# EasyEDA Pro project 电池内阻仪.eprj, schematic 电池内阻仪
Create Date: 2022-08-27; Page Name: 电池内阻仪; Project Name: 电池内阻仪; Schematic Name: 电池内阻仪; Update Date: 2023-02-27; Company: 嘉立创EDA
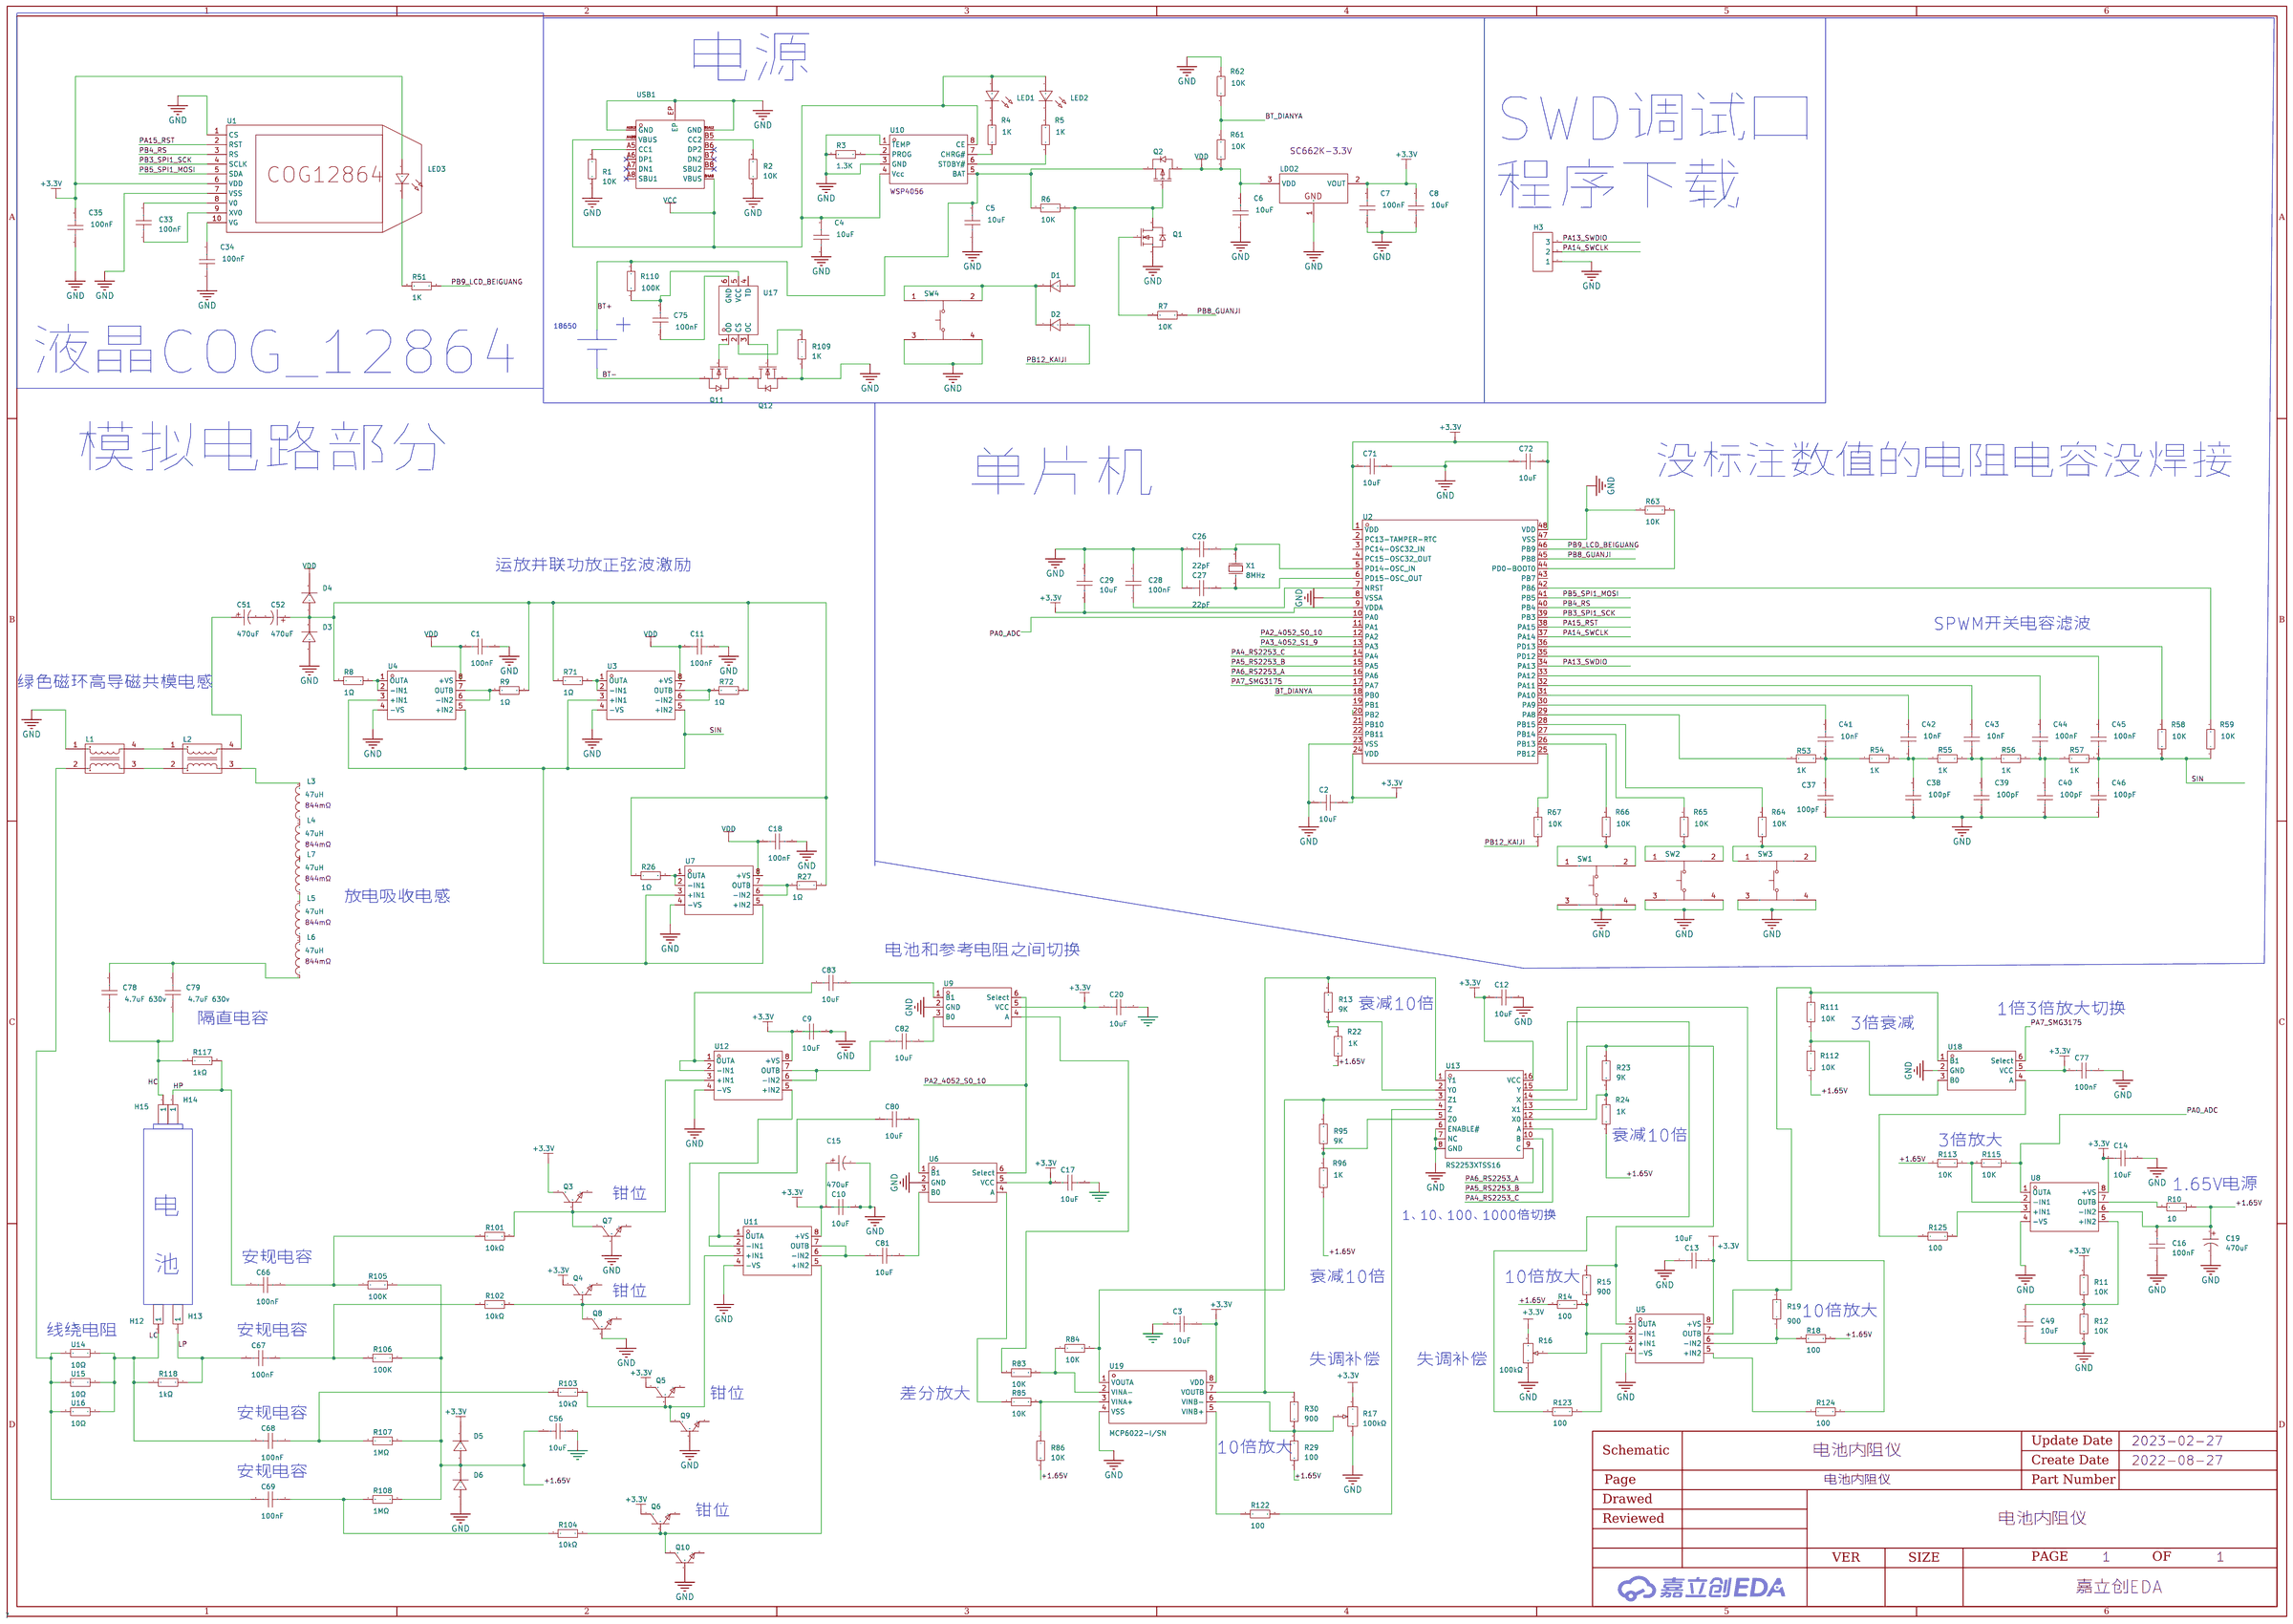
[diagram p0: schematic sheet]

## Parts
C1  100nF  [C0603]
C2  10uF  [C0603]
C3  10uF  [C0603]
C4  10uF  [C0603]
C5  10uF  [C0603]
C6  10uF  [C0603]
C7  100nF  [C0603]
C8  10uF  [C0603]
C9  10uF  [C0603]
C10  10uF  [C0603]
C11  100nF  [C0603]
C12  10uF  [C0603]
C13  10uF  [C0603]
C14  10uF  [C0603]
C15  470uF  [CAP-TH_BD8.0-P3.50-D0.6-FD]
C16  100nF  [C0603]
C17  10uF  [C0603]
C18  100nF  [C0603]
C19  470uF  [CAP-TH_BD8.0-P3.50-D0.6-FD]
C20  10uF  [C0603]
C26  22pF  [C0603]
C27  22pF  [C0603]
C28  100nF  [C0603]
C29  10uF  [C0603]
C33  100nF  [C0603]
C34  100nF  [C0603]
C35  100nF  [C0603]
C37  100pF  [C0603]
C38  100pF  [C0603]
C39  100pF  [C0603]
C40  100pF  [C0603]
C41  10nF  [C0603]
C42  10nF  [C0603]
C43  10nF  [C0603]
C44  100nF  [C0603]
C45  100nF  [C0603]
C46  100pF  [C0603]
C49  10uF  [C0603]
C51  470uF  [CAP-TH_BD8.0-P3.50-D0.6-FD]
C52  470uF  [CAP-TH_BD8.0-P3.50-D0.6-FD]
C56  10uF  [C0603]
C66  100nF  [CAP-TH_L13.0-W6.0-P10.00-D1.0]
C67  100nF  [CAP-TH_L13.0-W6.0-P10.00-D1.0]
C68  100nF  [CAP-TH_L13.0-W6.0-P10.00-D1.0]
C69  100nF  [CAP-TH_L13.0-W6.0-P10.00-D1.0]
C71  10uF  [C0603]
C72  10uF  [C0603]
C75  100nF  [C0603]
C77  100nF  [C0603]
C78  4.7uF 630v  [CAP-TH_L28.5-W15.5-P26.0-D0.8]
C79  4.7uF 630v  [CAP-TH_L28.5-W15.5-P26.0-D0.8]
C80  10uF  [C0603]
C81  10uF  [C0603]
C82  10uF  [C0603]
C83  10uF  [C0603]
D1  1N4148  [DO-35_BD2.0-L4.2-P8.20-D0.5-RD]
D2  1N4148  [DO-35_BD2.0-L4.2-P8.20-D0.5-RD]
D3  1N4148  [DO-35_BD2.0-L4.0-P8.00-D0.5-FD]
D4  1N4148  [DO-35_BD2.0-L4.0-P8.00-D0.5-FD]
D5  1N4148  [DO-35_BD2.0-L4.0-P8.00-D0.5-FD]
D6  1N4148  [DO-35_BD2.0-L4.0-P8.00-D0.5-FD]
H3  2.54-1*3P针  [HDR-TH_3P-P2.54-V-M-1]
H12  -  [HDR-TH_1P-V-M_XKB_X4611WV-01I-C28D40]
H13  -  [HDR-TH_1P-V-M_XKB_X4611WV-01I-C28D40]
H14  -  [HDR-TH_1P-V-M_XKB_X4611WV-01I-C28D40]
H15  -  [HDR-TH_1P-V-M_XKB_X4611WV-01I-C28D40]
L1  SLT1212V103MNP  [FILTER-TH_L18.0-W12.5-TL]
L2  SLT1212V103MNP  [FILTER-TH_L18.0-W12.5-TL]
L3  47uH  [IND-SMD_L4.5-W4.0_SLF0403]
L4  47uH  [IND-SMD_L4.5-W4.0_SLF0403]
L5  47uH  [IND-SMD_L4.5-W4.0_SLF0403]
L6  47uH  [IND-SMD_L4.5-W4.0_SLF0403]
L7  47uH  [IND-SMD_L4.5-W4.0_SLF0403]
LDO2  SC662K-3.3V  [SOT-23-3_L2.9-W1.3-P1.90-LS2.4-BR]
LED1  -  [LED-TH_BD3.0-P2.54-FD]
LED2  -  [LED-TH_BD3.0-P2.54-FD]
LED3  -  [LED-TH_BD3.0-P2.54-FD]
Q1  AO3400A  [SOT-23-3_L2.9-W1.3-P1.90-LS2.4-BR]
Q2  AO3401A  [SOT-23_L2.9-W1.3-P1.90-LS2.4-BR]
Q3  BC547  [TO-92-3_L4.5-W3.5-P1.27-L]
Q4  BC547  [TO-92-3_L4.5-W3.5-P1.27-L]
Q5  BC547  [TO-92-3_L4.5-W3.5-P1.27-L]
Q6  BC547  [TO-92-3_L4.5-W3.5-P1.27-L]
Q7  BC547  [TO-92-3_L4.5-W3.5-P1.27-L]
Q8  BC547  [TO-92-3_L4.5-W3.5-P1.27-L]
Q9  BC547  [TO-92-3_L4.5-W3.5-P1.27-L]
Q10  BC547  [TO-92-3_L4.5-W3.5-P1.27-L]
Q11  AO3400A  [SOT-23-3_L2.9-W1.3-P1.90-LS2.4-BR]
Q12  AO3400A  [SOT-23-3_L2.9-W1.3-P1.90-LS2.4-BR]
R1  10K  [R0603]
R2  10K  [R0603]
R3  1.3K  [R0603]
R4  1K  [R0603]
R5  1K  [R0603]
R6  10K  [R0603]
R7  10K  [R0603]
R8  1Ω  [R0603]
R9  1Ω  [R0603]
R10  10  [R0603]
R11  10K  [R0603]
R12  10K  [R0603]
R13  9K  [R0603]
R14  100  [R0603]
R15  900  [R0603]
R16  100kΩ  [RES-ADJ-TH_3P-L9.5-W4.9-P2.50-L_3296W]
R17  100kΩ  [RES-ADJ-TH_3P-L9.5-W4.9-P2.50-L_3296W]
R18  100  [R0603]
R19  900  [R0603]
R22  1K  [R0603]
R23  9K  [R0603]
R24  1K  [R0603]
R26  1Ω  [R0603]
R27  1Ω  [R0603]
R29  100  [R0603]
R30  900  [R0603]
R51  1K  [R0603]
R53  1K  [R0603]
R54  1K  [R0603]
R55  1K  [R0603]
R56  1K  [R0603]
R57  1K  [R0603]
R58  10K  [R0603]
R59  10K  [R0603]
R61  10K  [R0603]
R62  10K  [R0603]
R63  10K  [R0603]
R64  10K  [R0603]
R65  10K  [R0603]
R66  10K  [R0603]
R67  10K  [R0603]
R71  1Ω  [R0603]
R72  1Ω  [R0603]
R83  10K  [R0603]
R84  10K  [R0603]
R85  10K  [R0603]
R86  10K  [R0603]
R95  9K  [R0603]
R96  1K  [R0603]
R101  10kΩ  [RES-TH_BD2.3-L6.5-P10.50-D0.5]
R102  10kΩ  [RES-TH_BD2.3-L6.5-P10.50-D0.5]
R103  10kΩ  [RES-TH_BD2.3-L6.5-P10.50-D0.5]
R104  10kΩ  [RES-TH_BD2.3-L6.5-P10.50-D0.5]
R105  100K  [RES-TH_BD1.8-L3.2-P7.20-D0.4]
R106  100K  [RES-TH_BD1.8-L3.2-P7.20-D0.4]
R107  1MΩ  [RES-TH_BD1.8-L3.2-P7.20-D0.4]
R108  1MΩ  [RES-TH_BD1.8-L3.2-P7.20-D0.4]
R109  1K  [R0603]
R110  100K  [R0603]
R111  10K  [R0603]
R112  10K  [R0603]
R113  10K  [R0603]
R115  10K  [R0603]
R117  1kΩ  [Res_1/4W]
R118  1kΩ  [Res_1/4W]
R122  100  [R0603]
R123  100  [R0603]
R124  100  [R0603]
R125  100  [R0603]
SW1  TC-1109-C-B  [KEY-TH_4P-L4.5-W4.5-P3.00-LS5.8]
SW2  TC-1109-C-B  [KEY-TH_4P-L4.5-W4.5-P3.00-LS5.8]
SW3  TC-1109-C-B  [KEY-TH_4P-L4.5-W4.5-P3.00-LS5.8]
SW4  TC-1109-C-B  [KEY-TH_4P-L4.5-W4.5-P3.00-LS5.8]
U1  -  [FPC10]
U2  N32G430C8L7  [LQFP-48_L7.0-W7.0-P0.50-LS9.0-BL]
U3  COS722MR  [MSOP-8_L3.0-W3.0-P0.65-LS4.9-BL-1]
U4  COS722MR  [MSOP-8_L3.0-W3.0-P0.65-LS4.9-BL-1]
U5  COS722MR  [MSOP-8_L3.0-W3.0-P0.65-LS4.9-BL-1]
U6  SGM3157  [SC-70-6_L2.2-W1.3-P0.65-LS2.2-BR]
U7  COS722MR  [MSOP-8_L3.0-W3.0-P0.65-LS4.9-BL-1]
U8  COS722MR  [MSOP-8_L3.0-W3.0-P0.65-LS4.9-BL-1]
U9  SGM3157  [SC-70-6_L2.2-W1.3-P0.65-LS2.2-BR]
U10  WSP4056  [SOP-8_L5.1-W3.9-P1.27-LS6.0-BL]
U11  COS722MR  [MSOP-8_L3.0-W3.0-P0.65-LS4.9-BL-1]
U12  COS722MR  [MSOP-8_L3.0-W3.0-P0.65-LS4.9-BL-1]
U13  RS2253XTSS16  [TSSOP-16_L5.0-W4.4-P0.65-LS6.4-BL]
U14  10Ω  [RES-TH_BD6.0-L17.5-P21.50-D0.8]
U15  10Ω  [RES-TH_BD6.0-L17.5-P21.50-D0.8]
U16  10Ω  [RES-TH_BD6.0-L17.5-P21.50-D0.8]
U17  WSTDW01  [SOT-23-6_L2.9-W1.6-P0.95-LS2.8-BR]
U18  SGM3157  [SC-70-6_L2.2-W1.3-P0.65-LS2.2-BR]
U19  MCP6022-I/SN  [SOIC-8_L4.9-W3.9-P1.27-LS6.0-BL]
USB1  TYPEC-304-ACP16  [USB-C-SMD_TYPE-C-16P-1]
X1  8MHz  [OSC-TH_L10.0-W4.5-P5.00]

## Library data of the parts
C1 C4-C8 C11 C18 C26-C29 C33-C35 C37-C46 C49 = CAP_0603: 容值:100nF;精度:±10%;额定电压:50V;温度系数:X7R;; Supplier Footprint: 0603
C2 C3 C9 C10 C12-C14 C17 C20 C71 C72 = CL10A106KP8NNNC: 容值:10uF;精度:±10%;额定电压:10V;材质(温度系数):X5R;; LCSC Part Name: 10uF ±10% 10V; Supplier Part: C19702; Manufacturer: SAMSUNG(三星); Supplier Footprint: 0603; JLCPCB Part Class: Basic Part; Datasheet: https://atta.szlcsc.com/upload/public/pdf/source/20160103/1457707703378.pdf; Supplier: LCSC; Tolerance: ±10%; Voltage Rated: 10V; Temperature Coefficient: X5R
C15 C19 C51 C52 = KM477M016F12RR0VH2FP0: 容值:470uF;精度:±20%;额定电压:16V;电容体直径:8mm;电容体长度:12mm;脚间距:3.5mm;工作寿命:2000hrs@105;; LCSC Part Name: 470uF ±20% 16V; Supplier Part: C28067; Manufacturer: CX(承兴); Supplier Footprint: 直插,D8xL12mm; JLCPCB Part Class: Extended Part; Datasheet: https://atta.szlcsc.com/upload/public/pdf/source/20211027/06D6BA3719C264B639DC286D935D03EA.pdf; Supplier: LCSC; Tolerance: ±20%; Rated Voltage: 16V; φD: 8mm; L: 12mm; Lead Spacing: 3.5mm; Lifetime @ Temp: 2000hrs@105
C16 C56 C75 C77 C80-C83 = CAP_0603: Supplier Footprint: 0603
C66-C69 = MP2104K27C3X6LC: 等级:X2;容值:100nF;精度:±10%;; LCSC Part Name: 等级:X2 100nF ±10%; Supplier Part: C105759; Manufacturer: SRD(圣融达); Supplier Footprint: 插件,P=10mm; JLCPCB Part Class: Extended Part; Datasheet: https://atta.szlcsc.com/upload/public/pdf/source/20211112/28AD7BCA5F9A6D19E46F5213448E69C0.pdf; Supplier: LCSC; Subclass: X2; Tolerance: ±10%
C78 C79 = KP475J2J2603: 容值:4.7uF;精度:±5%;额定电压:630V;工作温度:-40℃~+100℃;额定电压(VAC):-;; LCSC Part Name: 4.7uF ±5% 630V; Supplier Part: C3019080; Manufacturer: KYET(科雅); Supplier Footprint: 径向引线,P=26mm; JLCPCB Part Class: Extended Part; Datasheet: https://atta.szlcsc.com/upload/public/pdf/source/20220523/12B2B36D66F3FE6DA8C3B05150F96247.pdf; Supplier: LCSC; Tolerance: ±5%; Voltage Rated: 630V; Operating Temperature: -40℃~+100℃
D1 D2 = 1N4148: 二极管配置:独立式;功率:500mW;直流反向耐压(Vr):75V;平均整流电流(Io):150mA;正向压降(Vf):1V@10mA;反向电流(Ir):5A@75V;反向恢复时间(trr):4ns;工作温度:+175@(Tj);; LCSC Part Name: 75V 150mA 4ns; Supplier Part: C406389; Manufacturer: GOOD-ARK(固锝); Supplier Footprint: DO-35; JLCPCB Part Class: Extended Part; Datasheet: https://atta.szlcsc.com/upload/public/pdf/source/20190724/C406389_39EB15FF1EE68DC8E61740104CC090CC.pdf; Supplier: LCSC; Diode Configuration: 独立式; Power Dissipation: 500mW; Reverse Voltage (Vr): 75V; Average Rectified Current (Io): 150mA; Forward Voltage (Vf@If): 1V@10mA; Reverse Leakage Current: 5A@75V; Reverse Recovery Time (trr): 4ns; Operating Temperature: +175@(Tj)
D3-D6 = 1N4148: 二极管配置:-;功率:500mW;直流反向耐压(Vr):75V;平均整流电流(Io):200mA;正向压降(Vf):1V@10mA;反向电流(Ir):5A@75V;反向恢复时间(trr):4ns;工作温度:+200@(Tj);; LCSC Part Name: 75V 200mA 4ns; Supplier Part: C14516; Manufacturer: ST(先科); Supplier Footprint: DO-35; JLCPCB Part Class: Extended Part; Datasheet: https://atta.szlcsc.com/upload/public/pdf/source/20140303/1457707004955.pdf; Supplier: LCSC; Power Dissipation: 500mW; Reverse Voltage (Vr): 75V; Average Rectified Current (Io): 200mA; Forward Voltage (Vf@If): 1V@10mA; Reverse Leakage Current: 5A@75V; Reverse Recovery Time (trr): 4ns; Operating Temperature: +200@(Tj)
H3 = 2.54-1*3P针: 间距:2.54mm;总PIN位数:3;排数:1;插针结构:1x3P;行距:-;安装类型:直插;圆针/方针:方针;额定电流:3A;额定电压:-;配合针长度:-;塑高:-;端接针长度:-;触头材质:-;触头镀层:-;工作温度范围:-40~+105;颜色:黑色;; LCSC Part Name: 2.54mm 1x3P 直插 方针; Supplier Part: C49257; Manufacturer: BOOMELE(博穆精密); Supplier Footprint: 插件,P=2.54mm; JLCPCB Part Class: Extended Part; Datasheet: https://atta.szlcsc.com/upload/public/pdf/source/20151109/1457707570948.pdf; Supplier: LCSC; Pitch: 2.54mm; Number of Pins: 3; Number of Rows: 1; Pin Structure: 1x3P; Mounting Type: 直插; Circluar Pins/Square Pins: 方针; Current Rating (Max): 3A; Operating Temperature Range: -40~+105; Color: 黑色
H12-H15 = HDR-M_2.54_1x1P: Supplier Part: C81276; Supplier Footprint: 插件; JLCPCB Part Class: Extended Part
L1 L2 = SLT1212V103MNP: DIP 1212 10mh 1.5A(min) 立式; LCSC Part Name: 共模电感; Supplier Part: C5149047; Manufacturer: Sunltech(韩国顺磁); Supplier Footprint: 插件; JLCPCB Part Class: Extended Part; Datasheet: https://atta.szlcsc.com/upload/public/pdf/source/20220824/B3B2927620CFCBD1665B2E124C02E741.pdf; Supplier: LCSC
L3-L7 = SLF0403-470KTT: 电感值:47uH;精度:±10%;额定电流:540mA;直流电阻(DCR):844mΩ;; LCSC Part Name: 47uH ±10% 540mA 844mΩ; Supplier Part: C182152; Manufacturer: Sunltech(韩国顺磁); Supplier Footprint: SMD; JLCPCB Part Class: Extended Part; Datasheet: https://atta.szlcsc.com/upload/public/pdf/source/20180622/C182152_7E479EAE8C34B9E34441182146F93730.pdf; Supplier: LCSC; Tolerance: ±10%; Rated Current: 540mA; DC Resistance (DCR): 844mΩ
LDO2 = SC662K-3.3V: 输出类型:固定;输出极性:正;输出通道数:1;最大输入电压:6V;输出电压:3.3V;压差:38mV@(10mA);输出电流:250mA;电源纹波抑制比(PRSS):50dB@(1kHz);; LCSC Part Name: Vin=6V Vout=3.3V 250mA 50dB@(1kHz); Supplier Part: C83932; Manufacturer: FM富满; Supplier Footprint: SOT-23(SOT-23-3); JLCPCB Part Class: Extended Part; Datasheet: https://atta.szlcsc.com/upload/public/pdf/watermark/20190926/C83932_A1FEE0F88F35A7AF4930BCB1098113C1.pdf; Supplier: LCSC; Output Type: 固定; Output Polarity: 正; Number of Outputs: 1; Maximum Input Voltage: 6V; Output Voltage: 3.3V; Dropout Voltage: 38mV@(10mA); Output Current: 250mA; Power Supply Rejection Ratio (PRSS): 50dB@(1kHz)
LED1-LED3 = LED_TH-R_3mm: Supplier Footprint: 插件
Q1 Q11 Q12 = AO3400A: 类型:N沟道;漏源电压(Vdss):30V;连续漏极电流(Id):5.8A;功率(Pd):1.4W;导通电阻(RDS(on)@Vgs,Id):35mΩ@10V,5.8A;阈值电压(Vgs(th)@Id):1.4V@250A;栅极电荷(Qg@Vgs):-;输入电容(Ciss@Vds):-;反向传输电容(Crss@Vds):-;; LCSC Part Name: N沟道 30V 5.8A; Supplier Part: C347475; Manufacturer: UMW(友台半导体); Supplier Footprint: SOT-23; JLCPCB Part Class: Extended Part; Datasheet: https://atta.szlcsc.com/upload/public/pdf/source/20220429/98B7D6B2B83615ED4523A0C76368EB06.pdf; Supplier: LCSC; Type: N沟道; Drain Source Voltage (Vdss): 30V; Continuous Drain Current (Id): 5.8A; Power Dissipation (Pd): 1.4W; Drain Source On Resistance (RDS(on)@Vgs,Id): 35mΩ@10V,5.8A; Gate Threshold Voltage (Vgs(th)@Id): 1.4V@250A
Q2 = AO3401A_C347476: 类型:P沟道;漏源电压(Vdss):30V;连续漏极电流(Id):4.1A;功率(Pd):350mW;导通电阻(RDS(on)@Vgs,Id):65mΩ@10V,4.2A;阈值电压(Vgs(th)@Id):1.3V@250A;; LCSC Part Name: P沟道 30V 4.1A; Supplier Part: C347476; Manufacturer: UMW(友台半导体); Supplier Footprint: SOT-23; JLCPCB Part Class: Extended Part; Datasheet: https://atta.szlcsc.com/upload/public/pdf/source/20220429/6D4E5D1601502BF561E1E660606ADA95.pdf; Supplier: LCSC; Type: P沟道; Drain Source Voltage (Vdss): 30V; Continuous Drain Current (Id): 4.1A; Power Dissipation (Pd): 350mW; Drain Source On Resistance (RDS(on)@Vgs,Id): 65mΩ@10V,4.2A; Gate Threshold Voltage (Vgs(th)@Id): 1.3V@250A
Q3-Q10 = BC547: LCSC Part Name: BC547 420-800 420-800; Supplier Part: C2910381; Manufacturer: CJ(江苏长电/长晶); Supplier Footprint: TO-92; JLCPCB Part Class: Extended Part; Datasheet: https://atta.szlcsc.com/upload/public/pdf/source/20220322/35437BB3E522E0C3E451097265A180DC.pdf; Supplier: LCSC
R1-R15 R18 R19 R22-R24 R26 R27 R29 R30 R51 R53-R59 R61-R67 R71 R72 R83-R86 R95 R96 R109-R113 R115 R122-R125 = Res_0603: Supplier Footprint: 0603
R16 R17 = 3296W-1-104_C118963: 阻值:100kΩ;精度:±10%;; LCSC Part Name: 100kΩ ±10% 短柄; Supplier Part: C118963; Manufacturer: BOCHEN(博晨); Manufacturer Part: 3296W-1-104; Supplier Footprint: 插件; JLCPCB Part Class: Extended Part; Datasheet: https://atta.szlcsc.com/upload/public/pdf/source/20171114/C118963_15106326662041117450.pdf; Supplier: LCSC; Tolerance: ±10%
R101-R104 = MF1/4W-10KΩ±1% T: 电阻类型:金属膜电阻;阻值:10kΩ;精度:±1%;温度系数:±100ppm/℃;最大工作电压:250V;工作温度范围:-55℃~+155℃;; LCSC Part Name: 金属膜电阻 10kΩ ±1%; Supplier Part: C119347; Manufacturer: CCO(千志电子); Supplier Footprint: 轴向引线; JLCPCB Part Class: Extended Part; Datasheet: https://atta.szlcsc.com/upload/public/pdf/source/20170718/C119347_1500346113643823003.pdf; Supplier: LCSC; Type: 金属膜电阻; Tolerance: ±1%; Temperature Coefficient: ±100ppm/℃; Overload Voltage (Max): 250V; Operating Temperature Range: -55℃~+155℃
R105-R108 = MF1/8W-100KΩ±1% T: 电阻类型:金属膜电阻;阻值:100kΩ;精度:±1%;功率:125mW;温度系数:±100ppm/℃;最大工作电压:150V;工作温度范围:-55℃~+155℃;; LCSC Part Name: 金属膜电阻 100kΩ ±1% 125mW; Supplier Part: C119225; Manufacturer: CCO(千志电子); Supplier Footprint: 插件,1.8x3.2mm; JLCPCB Part Class: Extended Part; Datasheet: https://atta.szlcsc.com/upload/public/pdf/source/20170718/C119225_1500346032771822881.pdf; Supplier: LCSC; Type: 金属膜电阻; Tolerance: ±1%; Power(Watts): 125mW; Temperature Coefficient: ±100ppm/℃; Overload Voltage (Max): 150V; Operating Temperature Range: -55℃~+155℃
R117 R118 = Res_AXIAL-1/4W: Supplier Footprint: 轴向引线
SW1-SW4 = TC-1109-C-B: 触点电流:50mA;额定电压(DC):12V;绝缘电阻:100mΩ;电路结构:单刀单掷;安装方式:直插;按钮形状:圆形按钮;按钮/盖帽颜色:黑色;带灯:无;作用力:260gf;机械寿命:100000;工作温度:-30~+85;引脚样式:PC引脚;开关长度:4.5mm;开关宽度:4.5mm;开关高度:4.3mm;带支架:否;; LCSC Part Name: 4.5*4.5*4.3 260gf 铜盖; Supplier Part: C381028; Manufacturer: XKB Connectivity(中国星坤); Supplier Footprint: 插件; JLCPCB Part Class: Extended Part; Datasheet: https://atta.szlcsc.com/upload/public/pdf/source/20200227/C381028_73BC0AA899763C0E54C1A3BBF749C676.pdf; Supplier: LCSC; Contact Current: 50mA; Voltage Rating (DC): 12V; Insulation Resistance: 100mΩ; Circuit: 单刀单掷; Mounting Style: 直插; Actuator Style: 圆形按钮; Actuator/Cap Color: 黑色; With Lamp: 无; Operating Force: 260gf; Mechanical Life: 100000; Operating Temperature: -30~+85; Pin Style: PC引脚; Switch Length: 4.5mm; Switch Width: 4.5mm; Switch Height: 4.3mm; Strike Gundam: 否
U1 = COG12864
U2 = N32G430C8L7: Supplier Part: C3032170; Manufacturer: Nations(国民技术); Supplier Footprint: LQFP48; JLCPCB Part Class: Extended Part; Datasheet: https://atta.szlcsc.com/upload/public/pdf/source/20220608/411F2C1C49F3955F5F0689A973473AF7.pdf; Supplier: LCSC
U3-U5 U7 U8 U11 U12 = COS722MR: 运放类型:低噪声运放;放大器组数:2;增益带宽积（GBP）:10MHz;压摆率（SR）:7.5 V/us;电源电压:2.1V ~ 5.5V;各通道供电电流:650uA;; LCSC Part Name: COS722MR 3级(168小时); Supplier Part: C726653; Manufacturer: COSINE(科山芯创); Supplier Footprint: MSOP-8; JLCPCB Part Class: Extended Part; Datasheet: https://atta.szlcsc.com/upload/public/pdf/source/20200925/C726653_8C4DEEE918D81B4566489376FD74F88A.pdf; Supplier: LCSC; Amplifier Type: 低噪声运放; Number of Circuits: 2; Voltage - Input Offset（Vos）: 5mV; Gain Bandwidth Product（GBP）: 10MHz; Slew Rate（SR）: 7.5 V/us; Output Type: Rail-to-Rail; Supply Voltage（Single）: 2.1V ~ 5.5V; Iq per channel (Typ): 650uA; Operating Temperature: -40~125
U6 U9 U18 = SGM3157: Supplier Part: C394901; Manufacturer: UMW(广东友台半导体); Supplier Footprint: SC-70-6; JLCPCB Part Class: Extended Part; Datasheet: https://atta.szlcsc.com/upload/public/pdf/source/20190529/C394901_0B4C9AD2B2C4D7402A9B434ADF7451EE.pdf; Supplier: LCSC
U10 = WSP4056: Supplier Part: C2985892; Manufacturer: WINSOK(微硕); Supplier Footprint: SOP-8; JLCPCB Part Class: Extended Part; Datasheet: https://atta.szlcsc.comnull; Supplier: LCSC
U13 = RS2253XTSS16: 开关电路:-;多路复用器/解复用器电路:-;导通电阻（最大值）:-;开关电压（最大值）:-;; Supplier Part: C2762339; Manufacturer: RUNIC(润石); Supplier Footprint: TSSOP-16; JLCPCB Part Class: Extended Part; Datasheet: https://atta.szlcsc.com/upload/public/pdf/watermark/20210326/C2762339_0D7BE0EC467357171233AF24BCA0D313.pdf; Supplier: LCSC
U14-U16 = KNP3W-10Ω±1%-9T73: 电阻类型:绕线电阻;阻值:10Ω;精度:±1%;功率:3W;温度系数:±350ppm/℃;最大工作电压:500V;工作温度范围:-55℃~+155℃;; LCSC Part Name: 绕线电阻 10Ω ±1% 3W; Supplier Part: C2843016; Manufacturer: VO(翔胜); Supplier Footprint: 插件,6x17mm; JLCPCB Part Class: Extended Part; Datasheet: https://atta.szlcsc.com/upload/public/pdf/source/20200609/C601736_823D5FEC32C33ED68EDB1181C52D1F38.pdf; Supplier: LCSC; Type: 绕线电阻; Tolerance: ±1%; Power(Watts): 3W; Temperature Coefficient: ±350ppm/℃; Overload Voltage (Max): 500V; Operating Temperature Range: -55℃~+155℃
U17 = WSTDW01: 充电电池的类型:-;电池单元组数:-;最大充电电流:-;充满的电池组电压:-;最大供应电压:-;; Supplier Part: C86873; Manufacturer: WINSOK(微硕); Supplier Footprint: SOT-23-6; JLCPCB Part Class: Extended Part; Datasheet: https://atta.szlcsc.com/upload/public/pdf/source/20161110/1478743415995.pdf; Supplier: LCSC
U19 = MCP6022-I/SN: 运放类型:宽带运放;放大器组数:2;增益带宽积（GBP）:10MHz;压摆率（SR）:7 V/us;电源电压:2.5V ~ 5.5V;各通道供电电流:1mA;; Supplier Part: C34047; Manufacturer: MICROCHIP(美国微芯); Supplier Footprint: SOIC-8-150mil; JLCPCB Part Class: Extended Part; Datasheet: https://atta.szlcsc.com/upload/public/pdf/source/20140723/1457707156733.pdf; Supplier: LCSC; Amplifier Type: 宽带运放; Number of Circuits: 2; Current - Input Bias（Ib）: 1pA; Voltage - Input Offset（Vos）: 500uV; Gain Bandwidth Product（GBP）: 10MHz; Slew Rate（SR）: 7 V/us; Output Type: 满摆幅; Supply Voltage（Single）: 2.5V ~ 5.5V; Iq per channel (Typ): 1mA; Operating Temperature: -40℃~85℃
USB1 = TYPEC-304-ACP16: 连接器类型:Type-C;公母:母座;触点数量:16;端口数量:1;安装方式:卧贴;额定电流 - 电源:3A;工作温度范围:-40~+85;; LCSC Part Name: Type-C 母座 卧贴; Supplier Part: C2982555; Manufacturer: XUNPU(讯普); Supplier Footprint: SMD; JLCPCB Part Class: Extended Part; Datasheet: https://atta.szlcsc.com/upload/public/pdf/source/20220311/3C907F75E12F45E4EE7F73565AB9C294.pdf; Supplier: LCSC; Connector Type: Type-C; Gender: 母座; Number of Contacts: 16; Number of Ports: 1; Mounting Style: 卧贴; Current Rating - Power (Max): 3A; Operating Temperature Range: -40~+85
X1 = X49SD8MSD2SC: 晶振类型:49S晶振;频率:8MHz;频率公差:±20ppm;频率稳定度:±30ppm;负载电容:20pF;工作温度:-20~+70;; LCSC Part Name: 8MHz ±20ppm 20pF; Supplier Part: C21263; Manufacturer: YXC(扬兴科技); Supplier Footprint: HC-49S-2P; JLCPCB Part Class: Extended Part; Datasheet: https://atta.szlcsc.com/upload/public/pdf/source/20210903/A997D130AE99CBB55D9024F9BE6DA174.pdf; Supplier: LCSC; Crystal Type: 49S晶振; Frequency Tolerance: ±20ppm; Frequency Stability: ±30ppm; Load Capacitance: 20pF; Operating Temperature: -20~+70

## Nets
+1.65V: C16.2 C19.1 C56.2 D5.1(A) D6.2(C) R10.1 R14.1 R18.1 R22.1 R24.1 R29.1 R86.2 R96.1 R105.2 R106.2 R107.2 R108.2 R112.2 R113.1 U8.6(-IN2)
+3.3V: C2.2 C3.1 C7.2 C8.2 C9.1 C10.1 C12.1 C13.2 C14.1 C17.1 C20.1 C29.1 C35.2 C71.1 C72.2 C77.1 D5.2(C) LDO2.2(VOUT) LED3.1(C) Q3.1(C) Q4.1(C) Q5.1(C) Q6.1(C) R11.2 R16.1 R17.1 U1.6(VDD) U2.1(VDD) U2.9(VDDA) U2.24(VDD) U2.48(VDD) U5.8(+VS) U6.5(VCC) U8.8(+VS) U9.5(VCC) U11.8(+VS) U12.8(+VS) U13.16(VCC) U18.5(VCC) U19.8(VDD)
GND: C1.2 C2.1 C3.2 C4.1 C5.1 C6.1 C7.1 C8.1 C9.2 C10.2 C11.2 C12.2 C13.1 C14.2 C15.1 C15.2 C16.1 C17.2 C18.2 C19.2 C20.2 C26.1 C27.1 C28.2 C29.2 C34.1 C35.1 C37.1 C38.1 C39.1 C40.1 C46.1 C49.1 C56.1 C71.2 C72.1 C77.2 D3.1(A) D6.1(A) H3.1 L1.1 LDO2.1(GND) Q1.2(S) Q7.2(B) Q8.2(B) Q9.2(B) Q10.2(B) Q12.2(S) R1.2 R2.1 R3.1 R12.1 R16.3 R17.3 R62.2 R63.1 R109.1 SW1.3 SW1.4 SW2.3 SW2.4 SW3.3 SW3.4 SW4.3 SW4.4 U1.1(CS) U1.7(VSS) U2.8(VSSA) U2.23(VSS) U2.47(VSS) U3.4(-VS) U4.4(-VS) U5.4(-VS) U6.2(GND) U7.4(-VS) U8.4(-VS) U9.2(GND) U10.1(TEMP) U10.3(GND) U11.4(-VS) U12.4(-VS) U13.6(ENABLE#) U13.7(NC) U13.8(GND) U18.2(GND) U19.4(VSS) USB1.A1B12(GND) USB1.B1A12(GND) USB1.EP
VCC: C4.2 LED1.1(C) LED2.1(C) U10.4(Vcc) U10.8(CE) USB1.A4B9(VBUS) USB1.B4A9(VBUS)
VDD: C1.1 C6.2 C11.1 C18.1 D4.2(C) LDO2.3(VDD) Q2.3(D) R61.1 U3.8(+VS) U4.8(+VS) U7.8(+VS)
BT+: C5.2 Q2.2(S) R6.2 R110.1 U10.5(BAT)
BT-: Q11.2(S)
BT_DIANYA: R61.2 R62.1 U2.18(PB0)
HC: C78.1 C79.1 H15.1 R117.1
HP: C66.2 H14.1 R117.2
LC: C68.2 H12.1 R118.1 U14.2 U15.2 U16.2
LP: C67.2 H13.1 R118.2
PA0_ADC: R115.2 U2.10(PA0) U8.1(OUTA)
PA2_4052_S0_10: U2.12(PA2) U6.6(Select) U9.6(Select)
PA3_4052_S1_9: U2.13(PA3)
PA4_RS2253_C: U2.14(PA4) U13.11(A)
PA5_RS2253_B: U2.15(PA5) U13.10(B)
PA6_RS2253_A: U2.16(PA6) U13.9(C)
PA7_SMG3175: U2.17(PA7) U18.6(Select)
PA13_SWDIO: H3.3 U2.34(PA13)
PA14_SWCLK: H3.2 U2.37(PA14)
PA15_RST: U1.2(RST) U2.38(PA15)
PB3_SPI1_SCK: U1.4(SCLK) U2.39(PB3)
PB4_RS: U1.3(RS) U2.40(PB4)
PB5_SPI1_MOSI: U1.5(SDA) U2.41(PB5)
PB8_GUANJI: R7.1 U2.45(PB8)
PB9_LCD_BEIGUANG: R51.2 U2.46(PB9)
PB12_KAIJI: D2.2(A) R67.1
SIN: C45.1 C46.2 R57.2 R58.1 R59.1 U3.3(+IN1) U3.5(+IN2) U4.3(+IN1) U4.5(+IN2) U7.3(+IN1) U7.5(+IN2)
$1N5478: R1.1 USB1.A5(CC1)
$1N5501: R2.2 USB1.B5(CC2)
$1N5982: R3.2 U10.2(PROG)
$1N6392: LED1.2(A) R4.2
$1N6468: LED2.2(A) R5.2
$1N6485: R4.1 U10.7(CHRG#)
$1N7176: R5.1 U10.6(STDBY#)
$1N9972: D1.2(A) Q1.3(D) Q2.1(G) R6.1
$1N10161: Q1.1(G) R7.2
$1N55108: C26.2 U2.5(PD14-OSC_IN) X1.1(OSC1)
$1N55316: C27.2 U2.6(PD15-OSC_OUT) X1.2(OSC2)
$1N56684: C28.1 U2.7(NRST)
$1N65263: C33.2 U1.8(V0)
$1N65484: C33.1 U1.9(XV0)
$1N65778: C34.2 U1.10(VG)
$1N76678: LED3.2(A) R51.1
$1N79731: R53.1 U2.29(PA8)
$1N83028: C38.2 C42.1 R54.2 R55.1
$1N83269: C39.2 C43.1 R55.2 R56.1
$1N83512: C40.2 C44.1 R56.2 R57.1
$1N86336: C41.2 U2.30(PA9)
$1N86592: C42.2 U2.31(PA10)
$1N86848: C43.2 U2.32(PA11)
$1N87104: C44.2 U2.33(PA12)
$1N87360: C45.2 U2.35(PD12)
$1N88068: R58.2 U2.36(PD13)
$1N90333: R59.2 U2.42(PB6)
$1N104798: R63.2 U2.44(PD0-BOOT0)
$1N112001: R67.2 U2.25(PB12)
$1N112276: R66.2 U2.26(PB13)
$1N112550: R65.2 U2.27(PB14)
$1N112826: R64.2 U2.28(PB15)
$1N150454: D1.1(C) D2.1(C) SW4.1 SW4.2
$1N155250: R66.1 SW1.1 SW1.2
$1N156292: R65.1 SW2.1 SW2.2
$1N157433: R64.1 SW3.1 SW3.2
$1N176679: C37.2 C41.1 R53.2 R54.1
$1N236262: R71.2 U3.1(OUTA) U3.2(-IN1)
$1N418401: R72.1 U3.6(-IN2) U3.7(OUTB)
$1N487783: C52.1 D3.2(C) D4.1(A) R8.1 R9.2 R26.1 R27.2 R71.1 R72.2
$1N488293: R8.2 U4.1(OUTA) U4.2(-IN1)
$1N488294: R9.1 U4.6(-IN2) U4.7(OUTB)
$1N489967: C51.2 C52.2
$1N490575: L1.4 L2.1
$1N490975: C51.1 L2.4
$1N503194: C66.1 R101.1 R105.1
$1N503385: C67.1 R102.1 R106.1
$1N503576: C68.1 R103.1 R107.1
$1N503767: C69.1 R104.1 R108.1
$1N568131: R26.2 U7.1(OUTA) U7.2(-IN1)
$1N568132: R27.1 U7.6(-IN2) U7.7(OUTB)
$1N576878: L3.1 L4.2
$1N578962: L4.1 L7.2
$1N579100: L5.2 L7.1
$1N579238: L5.1 L6.2
$1N591038: C49.2 R11.1 R12.2 U8.5(+IN2)
$1N593180: R10.2 U8.7(OUTB)
$1N605976: R95.1 R96.2 U13.5(Z0)
$1N607717: R23.1 R24.2 U13.12(X0)
$1N608651: R13.1 R22.2 U13.2(Y0)
$1N694579: C78.2 C79.2 L6.1
$1N714049: Q11.3(D) Q12.3(D)
$1N714635: Q12.1(G) U17.3(OC)
$1N714783: Q11.1(G) U17.1(OD)
$1N715797: C75.1 U17.6(GND)
$1N716096: R109.2 U17.2(CS)
$1N717039: C75.2 R110.2 U17.5(VCC)
$1N730779: R19.2 R111.1 U5.7(OUTB) U18.1(B1)
$1N731545: R111.2 R112.1 U18.3(B0)
$1N840106: R15.2 R23.2 U5.1(OUTA) U13.13(X1)
$1N841757: R14.2 R15.1 R16.2 U5.2(-IN1)
Net-(C69-2): C69.2 L1.2 U14.1 U15.1 U16.1
Net-(C80-1): C80.1 U11.1(OUTA) U11.2(-IN1)
Net-(C80-2): C80.2 U6.1(B1)
Net-(C81-1): C81.1 U11.6(-IN2) U11.7(OUTB)
Net-(C81-2): C81.2 U6.3(B0)
Net-(C82-1): C82.1 U12.6(-IN2) U12.7(OUTB)
Net-(C82-2): C82.2 U9.3(B0)
Net-(C83-1): C83.1 U12.1(OUTA) U12.2(-IN1)
Net-(C83-2): C83.2 U9.1(B1)
Net-(L1-3): L1.3 L2.2
Net-(L2-3): L2.3 L3.2
Net-(Q3-2): Q3.2(B) Q7.1(C) R101.2 U12.3(+IN1)
Net-(Q4-2): Q4.2(B) Q8.1(C) R102.2 U12.5(+IN2)
Net-(Q5-2): Q5.2(B) Q9.1(C) R103.2 U11.3(+IN1)
Net-(Q6-2): Q6.2(B) Q10.1(C) R104.2 U11.5(+IN2)
Net-(R13-2): R13.2 R30.1 U13.1(Y1) U19.7(VOUTB)
Net-(R17-2): R17.2 R29.2 R30.2 U19.6(VINB-)
Net-(R18-2): R18.2 R19.1 U5.6(-IN2)
Net-(R83-1): R83.1 U9.4(A)
Net-(R83-2): R83.2 R84.1 U19.2(VINA-)
Net-(R84-2): R84.2 R95.2 U13.3(Z1) U19.1(VOUTA)
Net-(R85-1): R85.1 U6.4(A)
Net-(R85-2): R85.2 R86.1 U19.3(VINA+)
Net-(R113-2): R113.2 R115.1 U8.2(-IN1)
Net-(R122-1): R122.1 U19.5(VINB+)
Net-(R122-2): R122.2 U13.4(Z)
Net-(R123-1): R123.1 U13.15(Y)
Net-(R123-2): R123.2 U5.3(+IN1)
Net-(R124-1): R124.1 U5.5(+IN2)
Net-(R124-2): R124.2 U13.14(X)
Net-(R125-1): R125.1 U18.4(A)
Net-(R125-2): R125.2 U8.3(+IN1)

Not connected (* = marked no-connect by the designer): Q3 3(E); Q4 3(E); Q5 3(E); Q6 3(E); Q7 3(E); Q8 3(E); Q9 3(E); Q10 3(E); U2 2(PC13-TAMPER-RTC) 3(PC14-OSC32_IN) 4(PC15-OSC32_OUT) 11(PA1) 19(PB1) 20(PB2) 21(PB10) 22(PB11) 43(PB7); U17 4(TD); USB1 A6(DP1)* A7(DN1)* A8(SBU1)* B6(DP2)* B7(DN2)* B8(SBU2)*

## Notes on the sheet
- 电源
- SWD调试口
  程序下载
- 18650
- +
- 液晶COG_12864
- 模拟电路部分
- 没标注数值的电阻电容没焊接
- 单片机
- 运放并联功放正弦波激励
- SPWM开关电容滤波
- 绿色磁环高导磁共模电感
- 放电吸收电感
- 电池和参考电阻之间切换
- 衰减10倍
- 1倍3倍放大切换
- 隔直电容
- 3倍衰减
- 衰减10倍
- 3倍放大
- 1.65V电源
- 电
  池
- 钳位
- 1、10、100、1000倍切换
- 安规电容
- 衰减10倍
- 10倍放大
- 钳位
- 10倍放大
- 线绕电阻
- 安规电容
- 失调补偿
- 失调补偿
- 钳位
- 差分放大
- 安规电容
- 10倍放大
- 安规电容
- 钳位
